# Altium schematic sheet Power_Supply.SchDoc: Bluetooth Gateway
size A3; CheckedBy: QUOCTHANG; DrawnBy: DONGKHOA; Revision: V1.0.0; SheetNumber: 5; SheetTotal: 10
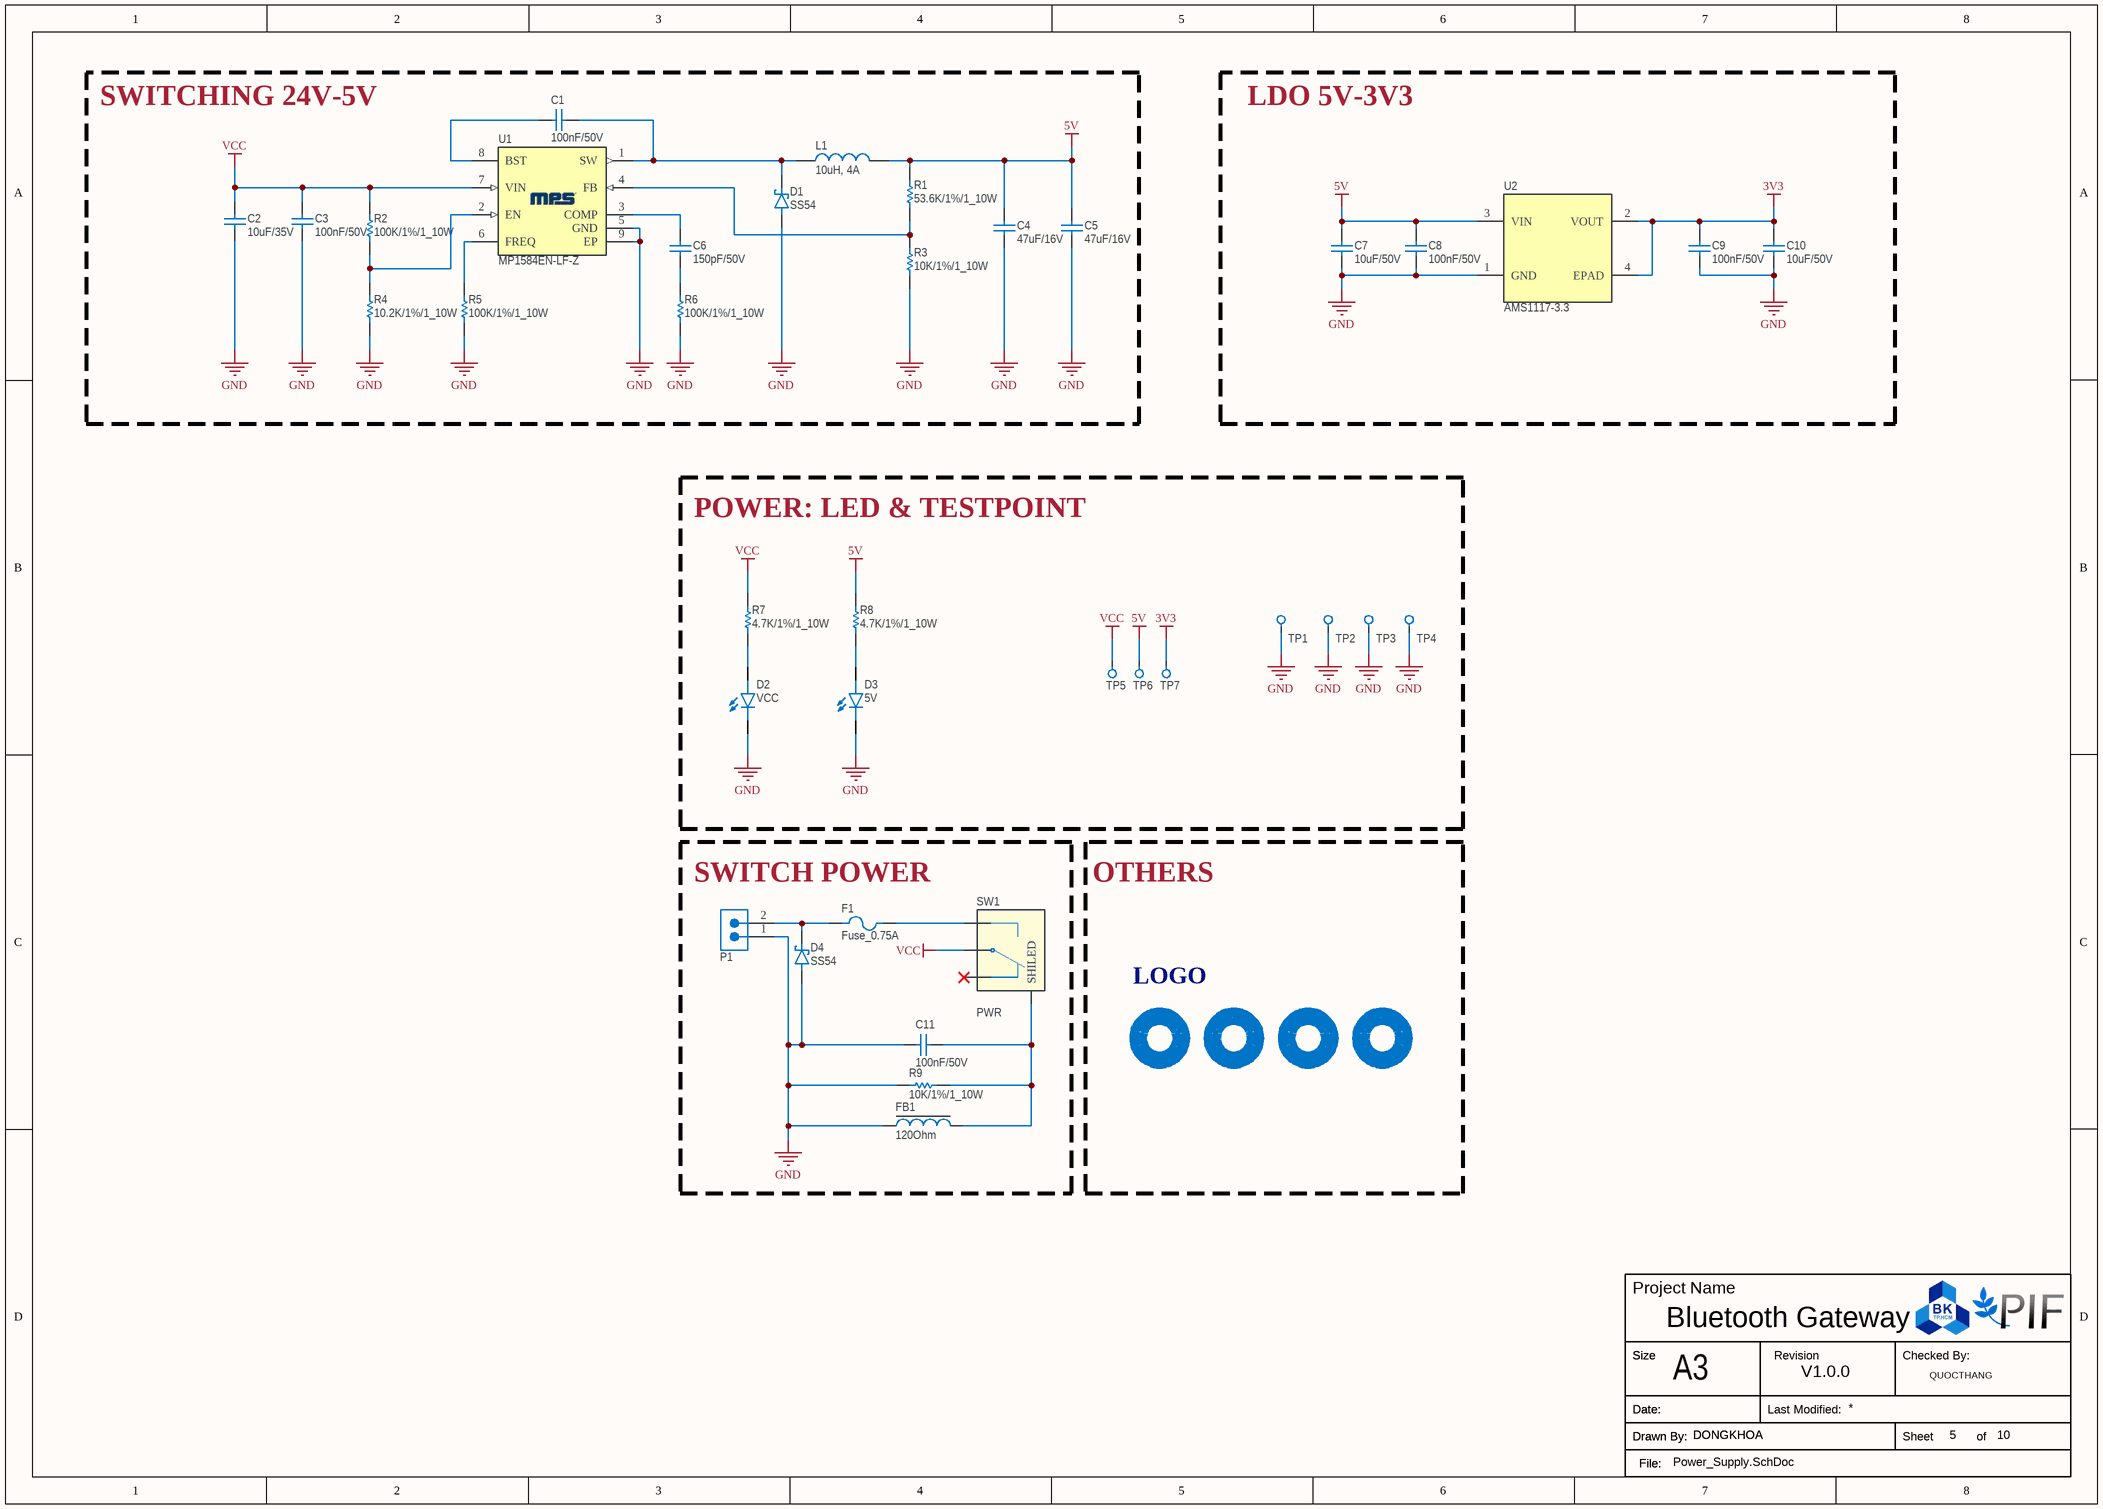
[diagram p0: Power_Supply.SchDoc]

## Parts
*1  LOGO  [BK_LOGO]  (value not drawn)
C1  100nF/50V  [CAP_0603]
C2  10uF/35V  [CAP_1206]
C3  100nF/50V  [CAP_1206]
C4  47uF/16V  [CAP_1206]
C5  47uF/16V  [CAP_1206]
C6  150pF/50V  [CAP_0603]
C7  10uF/50V  [CAP_0805]
C8  100nF/50V  [CAP_0805]
C9  100nF/50V  [CAP_0805]
C10  10uF/50V  [CAP_0805]
C11  100nF/50V  [CAP_0603]
D1  SS54  [D_SMA]
D2  VCC  [LED_0603Y]
D3  5V  [LED_0603Y]
D4  SS54  [D_SMA]
F1  Fuse_0.75A  [FUSER_MF-MSMF075/24-2]
FB1  120Ohm  [Ferrite_Bead_0805]
H1  Mounting Hole without connection  [MountingHole_3.2mm_M3_Pad_Via]  (value not drawn)
H2  Mounting Hole without connection  [MountingHole_3.2mm_M3_Pad_Via]  (value not drawn)
H3  Mounting Hole without connection  [MountingHole_3.2mm_M3_Pad_Via]  (value not drawn)
H4  Mounting Hole without connection  [MountingHole_3.2mm_M3_Pad_Via]  (value not drawn)
L1  10uH, 4A  [Inductor_0630]
P1  5.08mm_2P  [Terminal_Block_5.08mm_2P]  (value not drawn)
R1  53.6K/1%/1_10W  [Resistor_0603]
R2  100K/1%/1_10W  [Resistor_0603]
R3  10K/1%/1_10W  [Resistor_0603]
R4  10.2K/1%/1_10W  [Resistor_0603]
R5  100K/1%/1_10W  [Resistor_0603]
R6  100K/1%/1_10W  [Resistor_0603]
R7  4.7K/1%/1_10W  [Resistor_0603]
R8  4.7K/1%/1_10W  [Resistor_0603]
R9  10K/1%/1_10W  [Resistor_0603]
SW1  PWR  [MTS-102-C3]
TP1  GND  [TestPoint_Pad_3.0x3.0mm]  (value not drawn)
TP2  GND1  [TestPoint_Pad_3.0x3.0mm]  (value not drawn)
TP3  GND2  [TestPoint_Pad_3.0x3.0mm]  (value not drawn)
TP4  GND3  [TestPoint_Pad_3.0x3.0mm]  (value not drawn)
TP5  VCC  [TestPoint_Pad_3.0x3.0mm]  (value not drawn)
TP6  5V  [TestPoint_Pad_3.0x3.0mm]  (value not drawn)
TP7  3V3  [TestPoint_Pad_3.0x3.0mm]  (value not drawn)
U1  MP1584EN-LF-Z  [SOIC-8E]
U2  AMS1117-3.3  [SOT-223]

## Blocks framed on the sheet
SWITCHING 24V-5V: C1-C6 D1 L1 R1-R6 U1
LDO 5V-3V3: C7-C10 U2
POWER: LED & TESTPOINT: D2 D3 R7 R8 TP1-TP7
SWITCH POWER: C11 D4 F1 FB1 P1 R9 SW1
OTHERS: *1 H1-H4

## Nets
3V3: C9.2 C10.2 TP7.1 U2.2(VOUT) U2.4(EPAD)
5V: C4.2 C5.2 C7.2 C8.2 L1.2 R1.2 R8.2 TP6.1 U2.3(VIN)
GND: C2.1 C3.1 C4.1 C5.1 C7.1 C8.1 C9.1 C10.1 C11.2 D1.2(A) D2.C D3.C D4.2(A) FB1.2 P1.1 R3.1 R4.1 R5.1 R6.1 R9.1 TP1.1 TP2.1 TP3.1 TP4.1 U1.5(GND) U1.9(EP) U2.1(GND)
VCC: C2.2 C3.2 R2.2 R7.2 SW1.2 TP5.1 U1.7(VIN)
NetC1_1: C1.1 U1.8(BST)
NetC1_2: C1.2 D1.1(C) L1.1 U1.1(SW)
NetC6_1: C6.1 R6.2
NetC6_2: C6.2 U1.3(COMP)
NetC11_1: C11.1 FB1.1 R9.2 SW1.SH(SHILED)
NetD2_A: D2.A R7.1
NetD3_A: D3.A R8.1
NetD4_1: D4.1(C) F1.1 P1.2
NetF1_2: F1.2 SW1.3
NetR1_1: R1.1 R3.2 U1.4(FB)
NetR2_1: R2.1 R4.2 U1.2(EN)
NetR5_2: R5.2 U1.6(FREQ)

Not connected (* = marked no-connect by the designer): SW1 1*

## Notes on the sheet
- Project Name
- Size
- A3
- Revision
- Checked By:
- Drawn By:
- Date:
- File:
- Last Modified:
- Sheet
- of

## Library data of the parts
C1 C11 = Ceramic_Cap_100nF_50V_0603: CAP, size 0603, 100nF, 50V; Supply Part Number: Tụ Gốm 0603 100nF (0.1uF) 50V; Supply Name: Thegioiic; Datasheet: *; Supply URL: https://www.thegioiic.com/tu-gom-0603-100nf-0-1uf-50v
C2 = Ceramic_Cap_10uF_35V_1206: CAP, size 1206, 10uF, 35V; Supply Part Number: Tụ Gốm 1206 10uF 35V; Supply Name: Thegioiic; Datasheet: *; Supply URL: https://www.thegioiic.com/tu-gom-1206-10uf-35v
C3 = Ceramic_Cap_100nF_50V_1206: CAP, size 1206, 100nF, 50V; Supply Part Number: Tụ Gốm 1206 100nF (0.1uF) 50V; Supply Name: Thegioiic; Datasheet: *; Supply URL: https://www.thegioiic.com/tu-gom-1206-100nf-0-1uf-50v
C4 C5 = Ceramic_Cap_47uF_16V_1206: CAP, size 1206, 47uF, 16V; Supply Part Number: Tụ Gốm 1206 47uF 16V; Supply Name: Thegioiic; Datasheet: *; Supply URL: https://www.thegioiic.com/tu-gom-1206-47uf-16v
C6 = Ceramic_Cap_150pF_50V_0603: CAP, size 0603, 150pF, 50V; Supply Part Number: Tụ Gốm 0603 150pF 50V; Supply Name: Thegioiic; Datasheet: *; Supply URL: https://www.thegioiic.com/tu-gom-0603-150pf-50v
C7 C10 = Ceramic_Cap_10uF_50V_0805: CAP, size 0805, 10uF, 50V; Supply Part Number: Tụ Gốm 0805 10uF 50V; Supply Name: Thegioiic; Datasheet: *; Supply URL: https://www.thegioiic.com/tu-gom-0805-10uf-50v
C8 C9 = Ceramic_Cap_100nF_50V_0805: CAP, size 0805, 100nF, 50V; Supply Part Number: Tụ Gốm 0805 100nF (0.1uF) 50V; Supply Name: Thegioiic; Datasheet: *; Supply URL: https://www.thegioiic.com/tu-gom-0805-100nf-0-1uf-50v
D1 D4 = Diode_SS54: Diode Schottky 40V 5A Surface Mount SMA; Supply Part Number: SS54 SMA Diode Shotky 5A 40V; Supply Name: Thegioiic; Datasheet: https://www.thegioiic.com/upload/documents/dc8a63b3eda4738bc390d9dc570a4e18.pdf; Supply URL: https://www.thegioiic.com/ss54-sma-diode-shotky-5a-40v
D2 D3 = LED_Yellow_0603: LED Yellow 0603; Supply Part Number: LED Vàng 0603 Dán SMD Trong Suốt Harvatek; Supply Name: Thegioiic; Supply URL: https://www.thegioiic.com/led-vang-0603-dan-smd-trong-suot-harvatek
F1 = Fuse_24V_0.75A_1812: MF-MSMF075/24-2 Cầu Chì Tự Phục Hồi 1812 24V 0.75A; Supply Name: Thegioiic; Datasheet: https://www.bourns.com/docs/product-datasheets/mf-msmf.pdf?sfvrsn=4a75e5c0_64; Supply Part Number: MF-MSMF075/24-2 Cầu Chì Tự Phục Hồi 1812 24V 0.75A; Supply URL: https://www.thegioiic.com/mf-msmf075-24-2-cau-chi-tu-phuc-hoi-1812-24v-0-75a
FB1 = Ferrite_Bead_120Ohm_2A_0805: Ferrite Bead, size 0805, 120Ohm, 2A; Supply Part Number: CBW201209U121T Ferrite Beads 2A 120 Ohm 0805; Supply Name: Thegioiic; Supply URL: https://www.thegioiic.com/cbw201209u121t-ferrite-beads-2a-120-ohm-0805
H1-H4 = MountingHole: Datasheet: *; Supply Name: *; Supply Part Number: *; Supply URL: *
L1 = IND_10uH_0630: 10uH, 4A, Size 0630; Supply Part Number: Cuộn cảm 10UH 0630; Supply Name: icdayroi; Supply URL: https://icdayroi.com/cuon-cam-10uh-0630
P1 = Terminal_Block_5.08mm_2P: Terminal Block THT, pitch 5.08mm, 2p, 300V, 10A; Supply Part Number: UL-5.08-2-R Terminal Block Plug-in Hàn PCB 2 Chân Cong 5.08mm 300V 15A ULO; Supply Name: Thegioiic; Supply URL: https://www.thegioiic.com/ul-5-08-2-r-terminal-block-plug-in-han-pcb-2-chan-cong-5-08mm-300v-15a-ulo
R1 = Res_53.6K_0603_1%: Resistor 0603 53.6KOhm 1% 1_10W; Supply Part Number: Điện Trở 53.6 KOhm 0603 1%; Supply Name: Thegioiic; Supply URL: https://www.thegioiic.com/dien-tro-53-6-kohm-0603-1-
R2 R5 R6 = Res_100K_0603_1%: Resistor 0603 100KOhm 1% 1_10W; Supply Part Number: Điện Trở 100 KOhm 0603 1%; Supply Name: Thegioiic; Supply URL: https://www.thegioiic.com/dien-tro-100-kohm-0603-1-
R3 R9 = Res_10K_0603_1%: Resistor 0603 10KOhm 1% 1_10W; Supply Part Number: Điện Trở 10 KOhm 0603 1%; Supply Name: Thegioiic; Supply URL: https://www.thegioiic.com/dien-tro-10-kohm-0603-1-
R4 = Res_10.2K_0603_1%: Resistor 0603 10.2KOhm 1% 1_10W; Supply Part Number: Điện Trở 10.2 KOhm 0603 1%; Supply Name: Thegioiic; Supply URL: https://www.thegioiic.com/dien-tro-10-2-kohm-0603-1-
R7 R8 = Res_4.7K_0603_1%: Resistor 0603 4.7KOhm 1% 1_10W; Supply Part Number: Điện Trở 4.7 KOhm 0603 1%; Supply Name: Thegioiic; Supply URL: https://www.thegioiic.com/dien-tro-4-7-kohm-0603-1-
SW1 = MTS-102-C3: Switch Toggle; Supply Part Number: MTS-102-C3 Công Tắc Toggle ON-ON Gạt Giữ 3 Chân Cong 6A 125VAC; Supply Name: Thegioiic; Datasheet: *; Supply URL: https://www.thegioiic.com/mts-102-c3-cong-tac-toggle-on-on-gat-giu-3-chan-cong-6a-125vac
TP1-TP7 = Testpoint_SMD: Datasheet: *; Supply Name: *; Supply Part Number: *; Supply URL: *
U1 = MP1584EN-LF-Z: Buck Switching Regulator IC Positive Adjustable 0.8V 1 Output 3A 8-SOIC _0.154, 3.90mm Width_ Exposed Pad; Supply Name: tme; Datasheet: https://www.monolithicpower.com/en/documentview/productdocument/index/version/2/document_type/Datasheet/lang/en/sku/MP1584EN-LF-Z/document_id/204/?srsltid=AfmBOopCyUDyOs-uLll4YtNPir4o4STehG4B04EkgGGTflYW96m-OPS4; Supply Part Number: MP1584EN-LF-Z; Supply URL: http://www.tme.vn/Product.aspx?id=2070#page=pro_info
U2 = AMS1117-3.3: No Description Available; Supply Name: tme; Datasheet: http://www.advanced-monolithic.com/pdf/ds1117.pdf; Supply Part Number: AMS1117-3.3; Supply URL: http://tme.vn/Product.aspx?id=437#page=pro_info